# EAGLE design main (EAGLE 5.11)
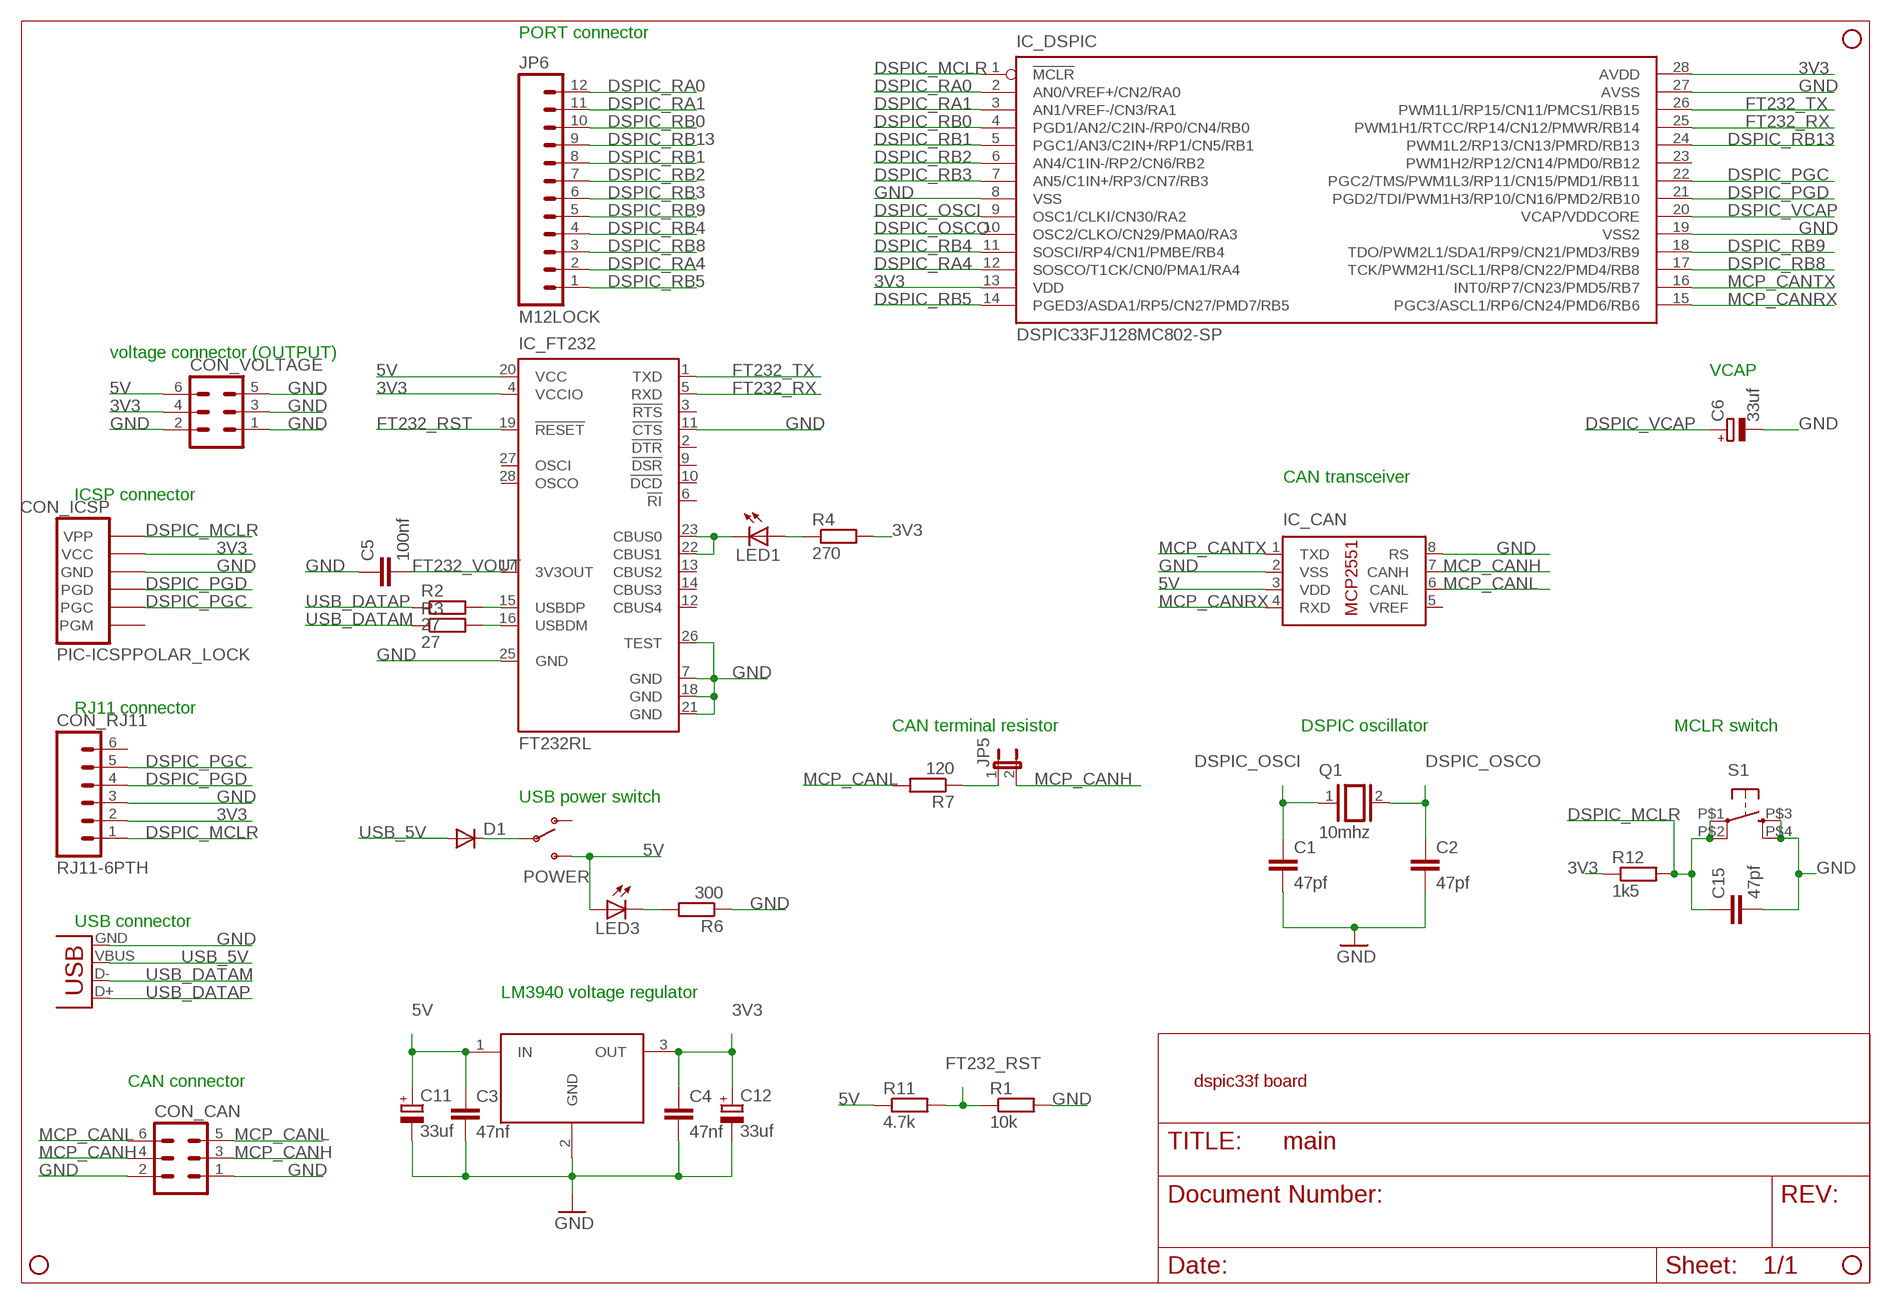
[diagram p0: schematic, sheet 1]

## Parts
C1  47pf  C-EU025-025X050  [C025-025X050]
C2  47pf  C-EU025-025X050  [C025-025X050]
C3  47nf  C-EU025-025X050  [C025-025X050]
C4  47nf  C-EU025-025X050  [C025-025X050]
C5  100nf  C-EU025-025X050  [C025-025X050]
C6  33uf  CPOL-EUE2,5-6E  [E2,5-6E]
C11  33uf  CPOL-EUE2,5-6E  [E2,5-6E]
C12  33uf  CPOL-EUE2,5-6E  [E2,5-6E]
C15  47pf  C-EU025-025X050  [C025-025X050]
CON_CAN  MA03-2  [MA03-2]
CON_ICSP  PIC-ICSPPOLAR_LOCK  [MOLEX-1X6_LOCK]
CON_RJ11  RJ11-6PTH  [RJ11-6]
CON_USB  USBPTH  [USB-B-PTH]
CON_VOLTAGE  MA03-2  [MA03-2]
D1  DIODE1N4148  [DIODE-1N4148]
IC_CAN  MCP2551/P  [DIL08]
IC_DSPIC  DSPIC33FJ128MC802-SP  [DIL28-3]
IC_FT232  FT232RL  [SSOP28]
IT1  LM3940IT-3.3  [TO220V]
JP2  STAND-OFF  [STAND-OFF]
JP3  STAND-OFF  [STAND-OFF]
JP4  STAND-OFF  [STAND-OFF]
JP5  JUMPER-2PTH  [1X02]
JP6  M12LOCK  [1X12_LOCK]
LED1  LED3MM  [LED3MM]
LED3  LED3MM  [LED3MM]
POWER  SWITCH-SPSTKIT  [SWITCH-SPDT_KIT]
Q1  10mhz  XTAL/S  [QS]
R1  10k  R-EU_0207/10  [0207/10]
R2  27  R-EU_0207/10  [0207/10]
R3  27  R-EU_0207/10  [0207/10]
R4  270  R-EU_0207/10  [0207/10]
R6  300  R-EU_0207/10  [0207/10]
R7  120  R-EU_0207/10  [0207/10]
R11  4.7k  R-EU_0207/10  [0207/10]
R12  1k5  R-EU_0207/10  [0207/10]
S1  TAC_SWITCHKSA_SEALED  [KSA_SEALED_TAC_SWITCH]

## Nets
3V3: C4.1 C12.+ CON_ICSP.5(VCC) CON_RJ11.2 CON_VOLTAGE.4 IC_DSPIC.13(VDD) IC_DSPIC.28(AVDD) IC_FT232.4(VCCIO) IT1.3(OUT) R4.2 R12.1
5V: C3.1 C11.+ CON_VOLTAGE.6 IC_CAN.3(VDD) IC_FT232.20(VCC) IT1.1(IN) LED3.A POWER.3(S) R11.1
DSPIC_MCLR: C15.1 CON_ICSP.6(VPP) CON_RJ11.1 IC_DSPIC.1(!MCLR) R12.2 S1.P$1 S1.P$2
DSPIC_OSCI: C1.1 IC_DSPIC.9(OSC1/CLKI/CN30/RA2) Q1.1
DSPIC_OSCO: C2.1 IC_DSPIC.10(OSC2/CLKO/CN29/PMA0/RA3) Q1.2
DSPIC_PGC: CON_ICSP.2(PGC) CON_RJ11.5 IC_DSPIC.22(PGC2/TMS/PWM1L3/RP11/CN15/PMD1/RB11)
DSPIC_PGD: CON_ICSP.3(PGD) CON_RJ11.4 IC_DSPIC.21(PGD2/TDI/PWM1H3/RP10/CN16/PMD2/RB10)
DSPIC_RA0: IC_DSPIC.2(AN0/VREF+/CN2/RA0) JP6.12
DSPIC_RA1: IC_DSPIC.3(AN1/VREF-/CN3/RA1) JP6.11
DSPIC_RA4: IC_DSPIC.12(SOSCO/T1CK/CN0/PMA1/RA4) JP6.2
DSPIC_RB0: IC_DSPIC.4(PGD1/AN2/C2IN-/RP0/CN4/RB0) JP6.10
DSPIC_RB1: IC_DSPIC.5(PGC1/AN3/C2IN+/RP1/CN5/RB1) JP6.8
DSPIC_RB2: IC_DSPIC.6(AN4/C1IN-/RP2/CN6/RB2) JP6.7
DSPIC_RB3: IC_DSPIC.7(AN5/C1IN+/RP3/CN7/RB3) JP6.6
DSPIC_RB4: IC_DSPIC.11(SOSCI/RP4/CN1/PMBE/RB4) JP6.4
DSPIC_RB5: IC_DSPIC.14(PGED3/ASDA1/RP5/CN27/PMD7/RB5) JP6.1
DSPIC_RB8: IC_DSPIC.17(TCK/PWM2H1/SCL1/RP8/CN22/PMD4/RB8) JP6.3
DSPIC_RB9: IC_DSPIC.18(TDO/PWM2L1/SDA1/RP9/CN21/PMD3/RB9) JP6.5
DSPIC_RB13: IC_DSPIC.24(PWM1L2/RP13/CN13/PMRD/RB13) JP6.9
DSPIC_VCAP: C6.+ IC_DSPIC.20(VCAP/VDDCORE)
FT232_RST: IC_FT232.19(!RESET) R1.1 R11.2
FT232_RX: IC_DSPIC.25(PWM1H1/RTCC/RP14/CN12/PMWR/RB14) IC_FT232.5(RXD)
FT232_TX: IC_DSPIC.26(PWM1L1/RP15/CN11/PMCS1/RB15) IC_FT232.1(TXD)
FT232_VOUT: C5.2 IC_FT232.17(3V3OUT)
GND: C1.2 C2.2 C3.2 C4.2 C5.1 C6.- C11.- C12.- C15.2 CON_CAN.1 CON_CAN.2 CON_ICSP.4(GND) CON_RJ11.3 CON_USB.GND CON_VOLTAGE.1 CON_VOLTAGE.2 CON_VOLTAGE.3 CON_VOLTAGE.5 IC_CAN.2(VSS) IC_CAN.8(RS) IC_DSPIC.8(VSS) IC_DSPIC.19(VSS2) IC_DSPIC.27(AVSS) IC_FT232.7(GND) IC_FT232.11(!CTS) IC_FT232.18(GND) IC_FT232.21(GND) IC_FT232.25(GND) IC_FT232.26(TEST) IT1.2(GND) R1.2 R6.1 S1.P$3 S1.P$4
MCP_CANH: CON_CAN.3 CON_CAN.4 IC_CAN.7(CANH) JP5.2
MCP_CANL: CON_CAN.5 CON_CAN.6 IC_CAN.6(CANL) R7.2
MCP_CANRX: IC_CAN.4(RXD) IC_DSPIC.15(PGC3/ASCL1/RP6/CN24/PMD6/RB6)
MCP_CANTX: IC_CAN.1(TXD) IC_DSPIC.16(INT0/RP7/CN23/PMD5/RB7)
N$1: D1.C POWER.2(P)
N$2: LED3.K(C) R6.2
N$4: JP5.1 R7.1
N$13: IC_FT232.15(USBDP) R2.2
N$17: IC_FT232.16(USBDM) R3.2
N$18: IC_FT232.22(CBUS1) IC_FT232.23(CBUS0) LED1.K(C)
N$20: LED1.A R4.1
USB_5V: CON_USB.VBUS D1.A
USB_DATAM: CON_USB.D- R3.1
USB_DATAP: CON_USB.D+ R2.1
Unconnected: CON_ICSP.1(PGM) CON_RJ11.6 IC_CAN.5(VREF) IC_DSPIC.23(PWM1H2/RP12/CN14/PMD0/RB12) IC_FT232.2(!DTR) IC_FT232.3(!RTS) IC_FT232.6(!RI) IC_FT232.9(!DSR) IC_FT232.10(!DCD) IC_FT232.12(CBUS4) IC_FT232.13(CBUS2) IC_FT232.14(CBUS3) IC_FT232.27(OSCI) IC_FT232.28(OSCO) POWER.1(O)

## Notes on the sheet
- PORT connector
- voltage connector (OUTPUT)
- VCAP
- CAN transceiver
- ICSP connector
- RJ11 connector
- CAN terminal resistor | DSPIC oscillator | MCLR switch
- USB power switch
- USB connector
- LM3940 voltage regulator
- CAN connector | dspic33f board

## Library data of the parts
C1-C5 C15 = resistor:C-EU: CAPACITOR, European symbol
C6 C11 C12 = resistor:CPOL-EU: POLARIZED CAPACITOR, European symbol
CON_CAN CON_VOLTAGE = con-lstb:MA03-2: PIN HEADER; OC_FARNELL: unknown; OC_NEWARK: unknown
CON_ICSP = SparkFun:PIC-ICSP: ISCP Programming connector for UAV, UBW Kit, etc.
CON_RJ11 = SparkFun:RJ11-6: RJ11 Jack Simple 6 pin RJ11 jack. Commonly found on CAT3 devices and Microchip programmers. SKU: PRT-00132
CON_USB = SparkFun:USB: USB Connectors USB-B-PTH is fully proven SKU : PRT-00139 USB-miniB is fully proven SKU : PRT-00587 USB-A-PCB is untested. USB-A-H is throughly reviewed, but untested. Spark Fun Electronics SKU : PRT-00437 USB-B-SMT is throughly reviewed, but untested. Needs silkscreen touching up. USB-A-S has not been used/tested USB-MB-H has not been used/tested
D1 = SparkFun:DIODE: Diode These are standard reverse protection diodes and small signal diodes. SMA package can handle up to about 1A. SOD-323 can handle about 200mA. What the SOD-323 package when ordering, there are some mfgs out there that are 5-pin packages.
IC_CAN = microchip-dspic:MCP2551: High-Speed CAN Transceiver
IC_DSPIC = microchip-dspic33fjxxmc:DSPIC33FJ128MC802: High-Performance, 16-bit Digital Signal Controllers - dsPIC33FJ32MC302/304, dsPIC33FJ64MCX02/X04, AND dsPIC33FJ128MCX02/X04 Package: 28-Pin SDIP, SOIC, QFN-S Operating Range: . Up to 40 MIPS operation (at 3.0-3.6V): - Industrial temperature range (-40°C to +85°C) - Extended temperature range (-40°C to +125°C) High-Performance DSC CPU: . Modified Harvard architecture . C compiler optimized instruction set . 16-bit wide data path . 24-bit wide instructions . Linear program memory addressing up to 4M instruction words . Linear data memory addressing up to 64 Kbytes . 83 base instructions: mostly 1 word/1 cycle . Two 40-bit accumulators with rounding and saturation options . Flexible and powerful addressing modes: - Indirect - Modulo - Bit-Reversed . Software stack . 16 x 16 fractional/integer multiply operations . 32/16 and 16/16 divide operations . Single-cycle multiply and accumulate: - Accumulator write back for DSP operations - Dual data fetch . Up to ±16-bit shifts for up to 40-bit data On-Chip Flash and SRAM: . Flash program memory . Data SRAM . Boot, Secure, and General Security for program Flash Direct Memory Access (DMA): . 8-channel hardware DMA . Up to 2 Kbytes dual ported DMA buffer area (DMA RAM) to store data transferred via DMA: - Allows data transfer between RAM and a peripheral while CPU is executing code (no cycle stealing) . Most peripherals support DMA Timers/Capture/Compare/PWM: . Timer/Counters, up to five 16-bit timers: - Can pair up to make two 32-bit timers - One timer runs as a Real-Time Clock with an external 32.768 kHz oscillator - Programmable prescaler . Input Capture (up to four channels): - Capture on up, down or both edges - 16-bit capture input functions - 4-deep FIFO on each capture . Output Compare (up to four channels): - Single or Dual 16-bit Compare mode - 16-bit Glitchless PWM mode . Hardware Real-Time Clock/Calendar (RTCC): - Provides clock, calendar, and alarm functions Interrupt Controller: . 5-cycle latency . 118 interrupt vectors . Up to 49 available interrupt sources . Up to three external interrupts . Seven programmable priority levels . Five processor exceptions Digital I/O: . Peripheral pin Select functionality . Up to 35 programmable digital I/O pins . Wake-up/Interrupt-on-Change for up to 21 pins . Output pins can drive from 3.0V to 3.6V . Up to 5V output with open drain configuration . All digital input pins are 5V tolerant . 4 mA sink on all I/O pins System Management: . Flexible clock options: - External, crystal, resonator, internal RC - Fully integrated Phase-Locked Loop (PLL) - Extremely low jitter PLL . Power-up Timer . Oscillator Start-up Timer/Stabilizer . Watchdog Timer with its own RC oscillator . Fail-Safe Clock Monitor . Reset by multiple sources Power Management: . On-chip 2.5V voltage regulator . Switch between clock sources in real time . Idle, Sleep, and Doze modes with fast wake-up Analog-to-Digital Converters (ADCs): . 10-bit, 1.1 Msps or 12-bit, 500 Ksps conversion: - Two and four simultaneous samples (10-bit ADC) - Up to 13 input channels with auto-scanning - Conversion start can be manual or synchronized with one of four trigger sources - Conversion possible in Sleep mode - ±2 LSb max integral nonlinearity - ±1 LSb max differential nonlinearity Audio Digital-to-Analog Converter (DAC): . 16-bit Dual Channel DAC module . 100 Ksps maximum sampling rate . Second-Order Digital Delta-Sigma Modulator Data Converter Interface (DCI) module: . Codec interface . Supports I2S and AC.97 protocols . Up to 16-bit data words, up to 16 words per frame . 4-word deep TX and RX buffers Comparator Module: . Two analog comparators with programmable input/output configuration CMOS Flash Technology: . Low-power, high-speed Flash technology . Fully static design . 3.3V (±10%) operating voltage . Industrial and Extended temperature . Low power consumption Communication Modules: . 4-wire SPI (up to two modules): - Framing supports I/O interface to simple codecs - Supports 8-bit and 16-bit data - Supports all serial clock formats and sampling modes . I2C?: - Full Multi-Master Slave mode support - 7-bit and 10-bit addressing - Bus collision detection and arbitration - Integrated signal conditioning - Slave address masking . UART (up to two modules): - Interrupt on address bit detect - Interrupt on UART error - Wake-up on Start bit from Sleep mode - 4-character TX and RX FIFO buffers - LIN bus support - IrDA® encoding and decoding in hardware - High-Speed Baud mode - Hardware Flow Control with CTS and RTS . Enhanced CAN (ECAN. module) 2.0B active: - Up to eight transmit and up to 32 receive buffers - 16 receive filters and three masks - Loopback, Listen Only and Listen All - Messages modes for diagnostics and bus monitoring - Wake-up on CAN message - Automatic processing of Remote Transmission Requests - FIFO mode using DMA - DeviceNet. addressing support . Parallel Master Slave Port (PMP/EPSP): - Supports 8-bit or 16-bit data - Supports 16 address lines . Programmable Cyclic Redundancy Check (CRC): - Programmable bit length for the CRC generator polynomial (up to 16-bit length) - 8-deep, 16-bit or 16-deep, 8-bit FIFO for data input
IC_FT232 = ftdichip:FT232R: Source: http://www.ftdichip.com/Documents/DataSheets/DS_FT232R_v104.pdf; MPN: FT232RL; OC_FARNELL: 1146032; OC_NEWARK: 91K9918
IT1 = LM3940:LM3940IT-3.3: 1A Low Dropout Regulator for 5V to 3.3V Conversion
JP2-JP4 = SparkFun:STAND-OFF: Stand Off This is the mechanical footprint for a #4 phillips button head screw. Use the keepout ring to avoid running the screw head into surrounding components. SKU : PRT-00447
JP5 = SparkFun:JUMPER-2: Jumper Basic 0.1" spaced jumper. Use with breakaway headers.
JP6 = SparkFun:M12: Header 12 Standard 12-pin 0.1" header. Use with straight break away headers (SKU : PRT-00116), right angle break away headers (PRT-00553), swiss pins (PRT-00743), machine pins (PRT-00117), and female headers (PRT-00115).
LED1 LED3 = led:LED: LED OSRAM: - CHIPLED LG R971, LG N971, LY N971, LG Q971, LY Q971, LO R971, LY R971 LH N974, LH R974 LS Q976, LO Q976, LY Q976 LO Q996 - Hyper CHIPLED LW Q18S LB Q993, LB Q99A, LB R99A - SideLED LS A670, LO A670, LY A670, LG A670, LP A670 LB A673, LV A673, LT A673, LW A673 LH A674 LY A675 LS A676, LA A676, LO A676, LY A676, LW A676 LS A679, LY A679, LG A679 - Hyper Micro SIDELED® LS Y876, LA Y876, LO Y876, LY Y876 LT Y87S - SmartLED LW L88C, LW L88S LB L89C, LB L89S, LG L890 LS L89K, LO L89K, LY L89K LS L896, LA L896, LO L896, LY L896 - TOPLED LS T670, LO T670, LY T670, LG T670, LP T670 LSG T670, LSP T670, LSY T670, LOP T670, LYG T670 LG T671, LOG T671, LSG T671 LB T673, LV T673, LT T673, LW T673 LH T674 LS T676, LA T676, LO T676, LY T676, LB T676, LH T676, LSB T676, LW T676 LB T67C, LV T67C, LT T67C, LS T67K, LO T67K, LY T67K, LW E67C LS E67B, LA E67B, LO E67B, LY E67B, LB E67C, LV E67C, LT E67C LW T67C LS T679, LY T679, LG T679 LS T770, LO T770, LY T770, LG T770, LP T770 LB T773, LV T773, LT T773, LW T773 LH T774 LS E675, LA E675, LY E675, LS T675 LS T776, LA T776, LO T776, LY T776, LB T776 LHGB T686 LT T68C, LB T68C - Hyper Mini TOPLED® LB M676 - Mini TOPLED Santana® LG M470 LS M47K, LO M47K, LY M47K Source: http://www.osram.convergy.de LUXEON: - LUMILED® LXK2-PW12-R00, LXK2-PW12-S00, LXK2-PW14-U00, LXK2-PW14-V00 LXK2-PM12-R00, LXK2-PM12-S00, LXK2-PM14-U00 LXK2-PE12-Q00, LXK2-PE12-R00, LXK2-PE12-S00, LXK2-PE14-T00, LXK2-PE14-U00 LXK2-PB12-K00, LXK2-PB12-L00, LXK2-PB12-M00, LXK2-PB14-N00, LXK2-PB14-P00, LXK2-PB14-Q00 LXK2-PR12-L00, LXK2-PR12-M00, LXK2-PR14-Q00, LXK2-PR14-R00 LXK2-PD12-Q00, LXK2-PD12-R00, LXK2-PD12-S00 LXK2-PH12-R00, LXK2-PH12-S00 LXK2-PL12-P00, LXK2-PL12-Q00, LXK2-PL12-R00 Source: www.luxeon.com KINGBRIGHT: KA-3528ASYC Source: www.kingbright.com
POWER = SparkFun:SWITCH-SPST: SPST Switch Simple slide switch. Spark Fun Electronics SKU : COM-00102
Q1 = special:XTAL/S: CRYSTAL
R1-R4 R6 R7 R11 R12 = resistor:R-EU_: RESISTOR, European symbol
S1 = SparkFun:TAC_SWITCH: Momentary Switch Button commonly used for reset or general input. Spark Fun Electronics SKU : COM-00097

## Net classes
0 default: width 0.203 mm, drill 0.508 mm, clearance 0.203 mm

## Board
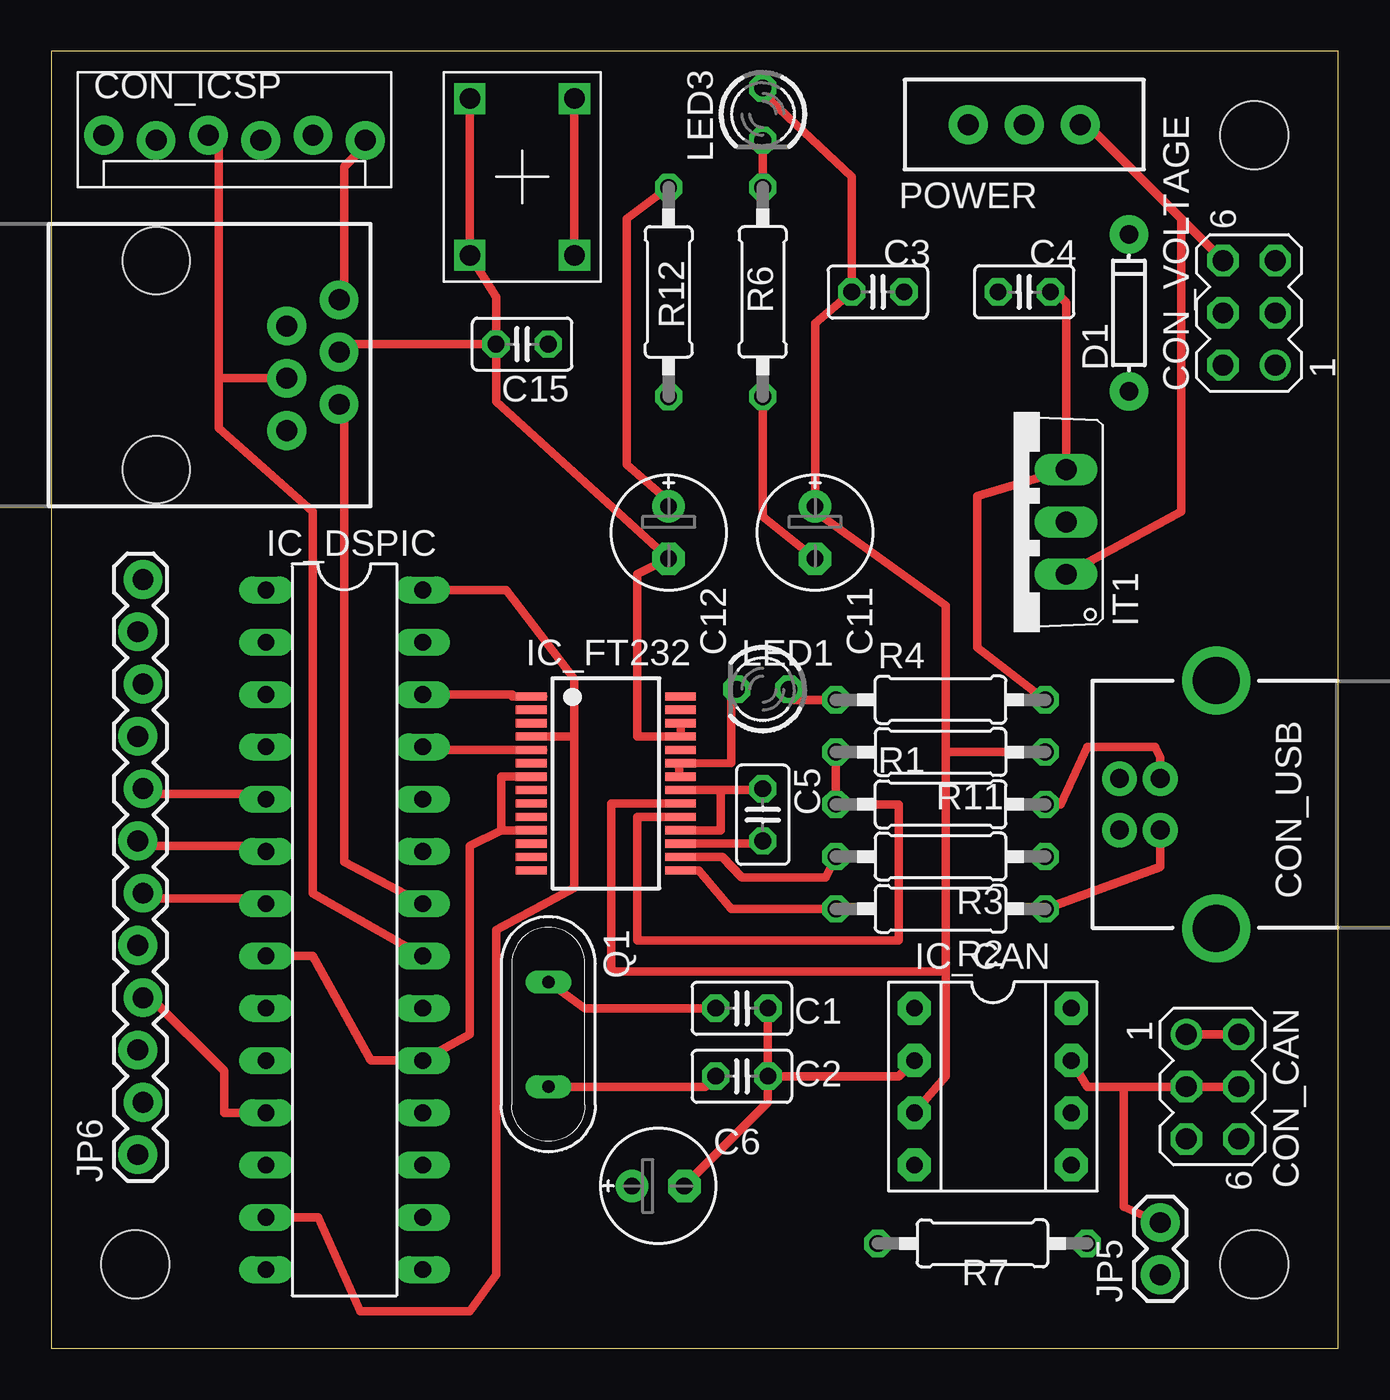
[diagram p1: board, top side]
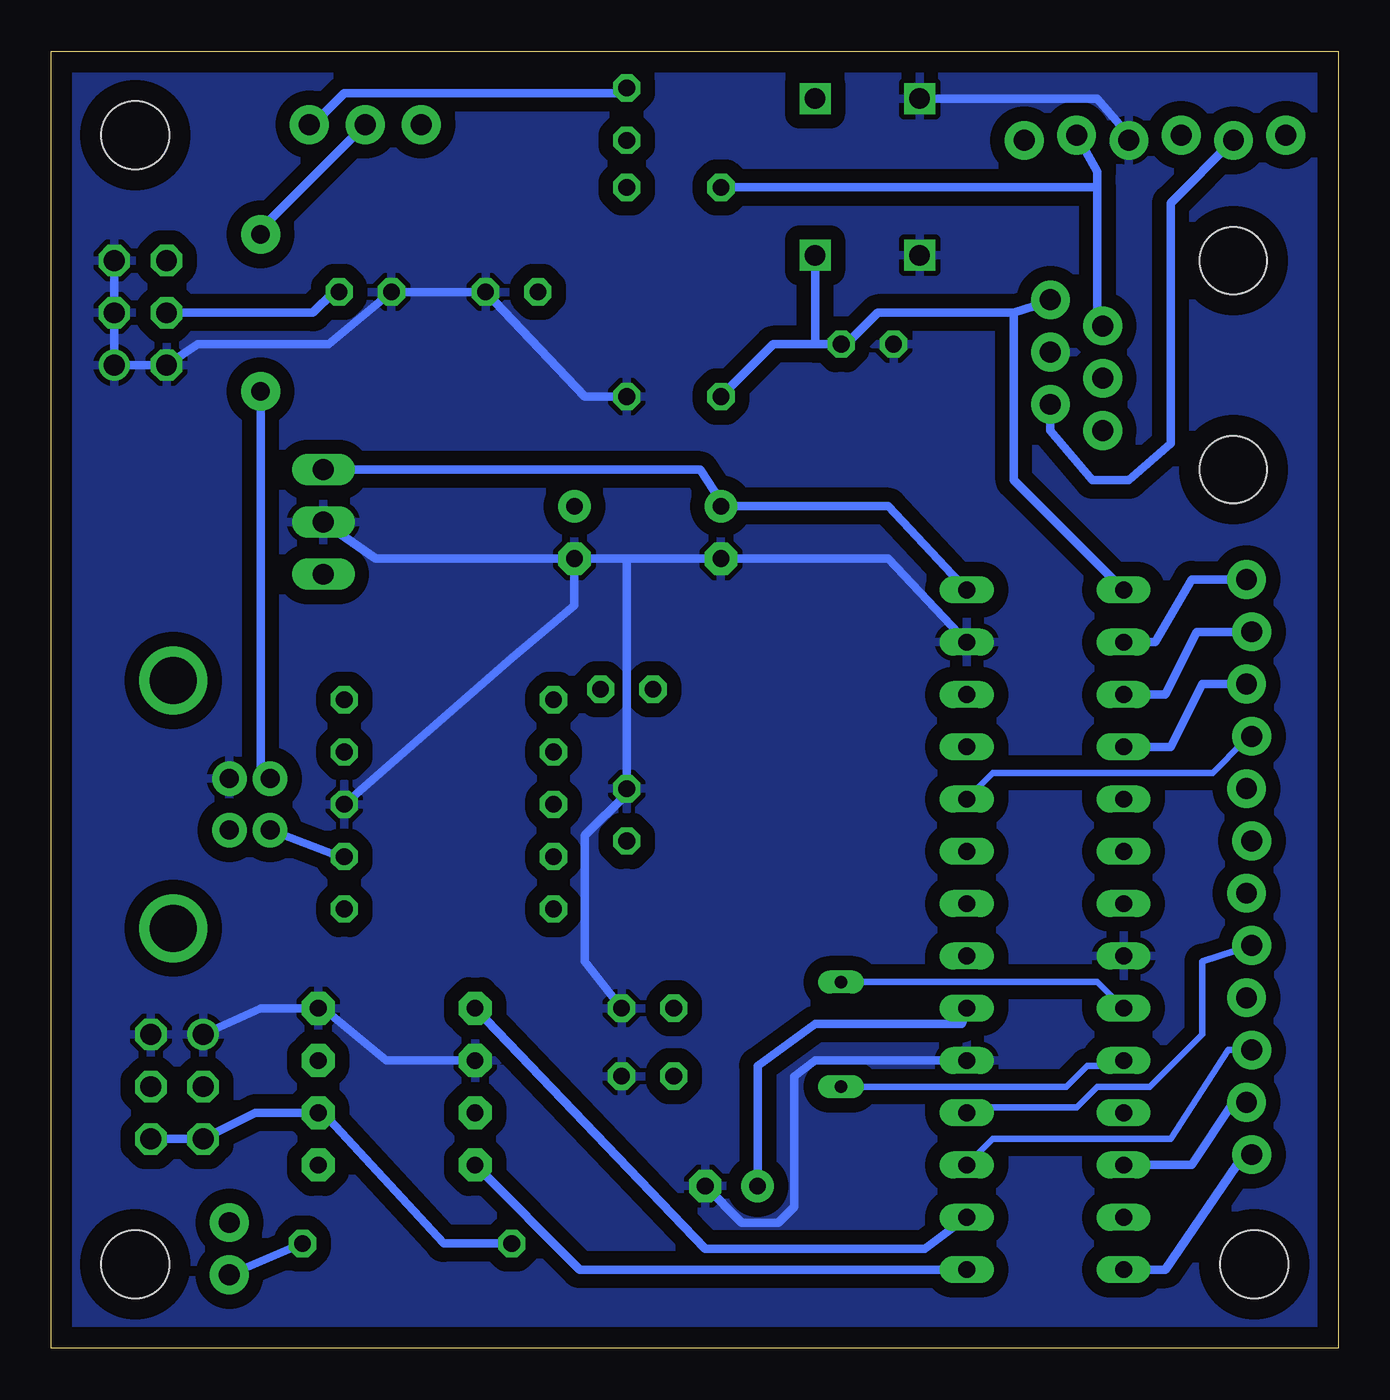
[diagram p2: board, bottom side, seen from below]

Size 62.48 x 62.99 mm. Coordinates in mm from the lower left corner, seen from the top.
Outline: 0,0 62.48,0 62.48,62.99 0,62.99 0,0
Copper layers (1*16): Top 0.035mm / dielectric 1.5mm / Bottom 0.035mm
Design rules "default *": minimum track width 10mil, minimum drill 24mil, track to track 10mil, track to pad 8mil, pad to pad 8mil, via to via 8mil, smd to smd 8mil, copper to edge 40mil, drill to drill 8mil, minimum pad ring 10mil, minimum via ring 8mil, stop-mask expansion 4mil, vias tented up to drill 0mil, thermal gap 10mil

### Footprints (pad centres in the part's own frame; a part is rotated, then mirrored left to right if it is on the bottom)
C025-025X050 = drill 0.813 octagon: 1 -1.27,0; 2 1.27,0
E2,5-6E = drill 0.813 pad 1.575 round: + -1.27,0 | drill 0.813 pad 1.575 octagon: - 1.27,0
MA03-2 = drill 1.016 round: 1 -2.54,-1.27 | drill 1.016 octagon: 2 -2.54,1.27; 3 0,-1.27; 4 0,1.27; 5 2.54,-1.27; 6 2.54,1.27
MOLEX-1X6_LOCK = drill 1.016 pad 1.88 round: 1 0,0; 2 2.54,-0.254; 3 5.08,0; 4 7.62,-0.254; 5 10.16,0; 6 12.7,-0.254
RJ11-6 = drill 1.016 pad 1.88 round: 1 1.905,8.89; 2 3.175,6.35; 3 4.445,8.89; 4 5.715,6.35; 5 6.985,8.89; 6 8.255,6.35 | hole 3.251: 0,0; 10.16,0
USB-B-PTH = drill 0.914 pad 1.676 round: D+ 0,1.25; D- 1.981,1.25; GND 0,-1.25; VBUS 1.981,-1.25 | drill 2.286 round: S1 -2.718,-6.02; S2 -2.718,6.02
DIODE-1N4148 = drill 0.9 pad 1.88 round: A -3.81,0; C 3.81,0
DIL08 = drill 0.813 pad 1.6 octagon: 1 -3.81,-3.81; 2 -1.27,-3.81; 3 1.27,-3.81; 4 3.81,-3.81; 5 3.81,3.81; 6 1.27,3.81; 7 -1.27,3.81; 8 -3.81,3.81
DIL28-3 = drill 0.813 long: 1 -16.51,-3.81; 2 -13.97,-3.81; 3 -11.43,-3.81; 4 -8.89,-3.81; 5 -6.35,-3.81; 6 -3.81,-3.81; 7 -1.27,-3.81; 8 1.27,-3.81; 9 3.81,-3.81; 10 6.35,-3.81; 11 8.89,-3.81; 12 11.43,-3.81; 13 13.97,-3.81; 14 16.51,-3.81; 15 16.51,3.81; 16 13.97,3.81; 17 11.43,3.81; 18 8.89,3.81; 19 6.35,3.81; 20 3.81,3.81; 21 1.27,3.81; 22 -1.27,3.81; 23 -3.81,3.81; 24 -6.35,3.81; 25 -8.89,3.81; 26 -11.43,3.81; 27 -13.97,3.81; 28 -16.51,3.81
SSOP28 = smd 0.4 x 1.5: 1 -4.225,-3.625; 2 -3.575,-3.625; 3 -2.925,-3.625; 4 -2.275,-3.625; 5 -1.625,-3.625; 6 -0.975,-3.625; 7 -0.325,-3.625; 8 0.325,-3.625; 9 0.975,-3.625; 10 1.625,-3.625; 11 2.275,-3.625; 12 2.925,-3.625; 13 3.575,-3.625; 14 4.225,-3.625; 15 4.225,3.625; 16 3.575,3.625; 17 2.925,3.625; 18 2.275,3.625; 19 1.625,3.625; 20 0.975,3.625; 21 0.325,3.625; 22 -0.325,3.625; 23 -0.975,3.625; 24 -1.625,3.625; 25 -2.275,3.625; 26 -2.925,3.625; 27 -3.575,3.625; 28 -4.225,3.625
TO220V = drill 1.016 long: 1 -2.54,-2.54; 2 0,-2.54; 3 2.54,-2.54
STAND-OFF = hole 3.302: 0,0
1X02 = drill 1.016 pad 1.88 round: 1 0,0; 2 2.54,0
1X12_LOCK = drill 1.016 pad 1.88 round: 1 0,0.127; 2 2.54,-0.127; 3 5.08,0.127; 4 7.62,-0.127; 5 10.16,0.127; 6 12.7,-0.127; 7 15.24,0.127; 8 17.78,-0.127; 9 20.32,0.127; 10 22.86,-0.127; 11 25.4,0.127; 12 27.94,-0.127
LED3MM = drill 0.813 octagon: A -1.27,0; K 1.27,0
SWITCH-SPDT_KIT = drill 1.016 pad 1.88 round: 1 0,2.718; 2 0,0; 3 0,-2.718
QS = drill 0.61 long: 1 -2.54,0; 2 2.54,0
0207/10 = drill 0.813 octagon: 1 -5.08,0; 2 5.08,0
KSA_SEALED_TAC_SWITCH = drill 1 square: P$1 -3.81,2.54; P$2 3.81,2.54; P$3 -3.81,-2.54; P$4 3.81,-2.54

### Placement (x,y rotation side)
C1  33.53,16.51 0 top
C2  33.53,13.21 0 top
C3  40.13,51.31 0 top
C4  47.24,51.31 180 top
C5  34.54,25.91 270 top
C6  29.46,7.87 0 top
C11  37.08,39.62 270 top
C12  29.97,39.62 270 top
C15  22.86,48.77 180 top
CON_CAN  56.39,12.7 270 top
CON_ICSP  2.54,58.93 0 top
CON_RJ11  5.08,52.83 270 top
CON_USB  53.85,26.42 180 top
CON_VOLTAGE  58.17,50.29 90 top
D1  52.32,50.29 90 top
IC_CAN  45.72,12.7 270 top
IC_DSPIC  14.22,20.32 270 top
IC_FT232  26.92,27.43 270 top
IT1  46.74,40.13 90 top
JP2  58.42,58.93 0 top
JP3  58.42,4.06 0 top
JP4  4.06,4.06 0 top
JP5  53.85,3.56 90 top
JP6  4.32,9.4 90 top
LED1  34.54,32 180 top
LED3  34.54,59.94 270 top
POWER  47.24,59.44 90 top
Q1  24.13,15.24 270 top
R1  43.18,26.42 0 top
R2  43.18,21.34 180 top
R3  43.18,23.88 180 top
R4  43.18,31.5 0 top
R6  34.54,51.31 90 top
R7  45.21,5.08 180 top
R11  43.18,28.96 180 top
R12  29.97,51.31 270 top
S1  22.86,56.9 270 top

### Tracks (layer width: path | path; a pad name or v marks a point on that pad's centre or on a via)
3V3
  Top 0.406: R4.2 44.96,34.04 44.96,41.4 IT1.3 49.28,50.8 48.77,51.31 C4.1 | R12.1 27.94,54.86 27.94,42.93 29.97,41.15 C12.+ | 25.4,29.71 25.4,32.51 22.1,36.83 IC_DSPIC.28 | 25.4,29.71 IC_FT232.4 | 25.4,29.71 25.4,22.35 21.59,20.32 21.59,3.56 20.32,1.78 14.99,1.78 12.95,6.35 IC_DSPIC.13
  Bottom 0.406: CON_VOLTAGE.4 49.78,50.29 48.77,51.31 C4.1 | 11.68,56.39 11.68,57.15 CON_ICSP.5 | 11.68,56.39 11.68,50.29 CON_RJ11.2 | R12.1 11.68,56.39 | IT1.3 30.99,42.67 29.97,41.15 C12.+ 21.84,40.89 IC_DSPIC.28
5V
  Top 0.406: 54.86,54.86 50.29,59.44 POWER.3 | 54.86,54.86 CON_VOLTAGE.6 | IT1.1 54.86,40.64 54.86,54.86 | LED3.A 34.54,60.96 38.86,56.9 C3.1 37.08,49.78 C11.+ 37.08,40.64 43.43,36.07 43.43,28.96 | IC_CAN.3 43.43,13.21 43.43,18.29 | 43.43,18.29 43.43,28.96 | IC_FT232.20 27.18,26.46 27.18,18.29 43.43,18.29 | 43.43,28.96 R11.1
  Bottom 0.406: POWER.3 49.78,59.44 48.26,60.96 34.54,60.96 LED3.A
DSPIC_MCLR
  Top 0.406: S1.P$2 S1.P$1 | CON_ICSP.6 15.24,58.42 14.22,57.4 14.22,51.31 CON_RJ11.1
  Bottom 0.406: R12.2 27.43,48.77 25.4,48.77 | 25.4,48.77 C15.1 23.88,48.77 22.35,50.29 15.75,50.29 | 25.4,48.77 S1.P$2 | 15.75,50.29 15.75,42.16 IC_DSPIC.1 | 15.75,50.29 14.22,50.8 CON_RJ11.1
DSPIC_OSCI
  Top 0.406: C1.1 25.91,16.51 Q1.1
  Bottom 0.305: Q1.1 11.68,17.78 IC_DSPIC.9
DSPIC_OSCO
  Top 0.406: C2.1 31.75,12.7 Q1.2
  Bottom 0.305: Q1.2 13.21,12.7 12.19,13.72 10.67,13.72 IC_DSPIC.10
DSPIC_PGC
  Top 0.406: CON_RJ11.5 14.22,45.59 14.22,23.62 IC_DSPIC.22
  Bottom 0.406: CON_ICSP.2 8.13,55.63 8.13,43.94 10.16,42.16 11.94,42.16 13.97,44.58 CON_RJ11.5
DSPIC_PGD
  Top 0.406: IC_DSPIC.21 12.7,22.1 12.7,40.64 8.13,44.7 8.13,47.12 | 8.13,47.12 CON_RJ11.4 | 8.13,47.12 8.13,58.67 CON_ICSP.3
DSPIC_RA0
  Bottom 0.406: IC_DSPIC.2 8.89,34.29 7.11,37.34 JP6.12
DSPIC_RA1
  Bottom 0.406: IC_DSPIC.3 8.38,31.75 6.86,34.8 JP6.11
DSPIC_RA4
  Bottom 0.406: IC_DSPIC.12 7.11,8.89 5.08,11.94 JP6.2
DSPIC_RB0
  Bottom 0.406: IC_DSPIC.4 8.13,29.21 6.6,32.26 JP6.10
DSPIC_RB1
  Top 0.406: IC_DSPIC.5 10.16,26.92 4.57,26.92 JP6.8
DSPIC_RB2
  Top 0.406: IC_DSPIC.6 10.16,24.38 4.57,24.38 JP6.7
DSPIC_RB3
  Top 0.406: IC_DSPIC.7 10.16,21.84 4.57,21.84 JP6.6
DSPIC_RB4
  Top 0.406: IC_DSPIC.11 8.38,11.43 8.38,13.46 4.83,17.02 JP6.4
DSPIC_RB5
  Bottom 0.406: IC_DSPIC.14 8.38,3.81 4.57,9.4 JP6.1
DSPIC_RB8
  Bottom 0.305: IC_DSPIC.17 16.76,10.16 8.13,10.16 5.33,14.48 JP6.3
DSPIC_RB9
  Bottom 0.305: IC_DSPIC.18 17.78,11.68 12.7,11.68 11.68,12.7 9.14,12.7 6.6,15.24 6.6,18.8 JP6.5
DSPIC_RB13
  Bottom 0.305: IC_DSPIC.24 16.76,27.94 6.1,27.94 4.57,29.46 JP6.9
DSPIC_VCAP
  Bottom 0.406: IC_DSPIC.20 18.29,15.75 25.4,15.75 28.19,13.72 C6.+
FT232_RST
  Top 0.406: R11.2 R1.1 41.15,26.42 41.15,19.81 28.45,19.81 28.45,25.81 IC_FT232.19
FT232_RX
  Top 0.406: IC_DSPIC.25 18.54,29.21 18.77,29.05 22.51,29.05 | 22.51,29.05 23.88,29.06 | 22.51,29.05 IC_FT232.5
FT232_TX
  Top 0.406: IC_DSPIC.26 22.37,31.75 22.37,31.66 IC_FT232.1 | IC_FT232.1 23.89,31.66 | IC_FT232.1
FT232_VOUT
  Top 0.406: IC_FT232.17 34.54,24.51 C5.2
GND
  Top 0.406: S1.P$3 S1.P$4 21.59,51.05 C15.2 | 32.51,27.11 34.54,27.11 C5.1 | 32.51,27.11 IC_FT232.21 | IC_FT232.18 32.51,25.16 32.51,27.11 | IC_FT232.7 21.84,27.76 21.84,25.16 | 21.84,25.16 IC_FT232.11 | CON_CAN.1 CON_CAN.2 | C15.2 14.48,48.77 CON_RJ11.3 | C15.2 21.59,45.97 C12.- 28.45,37.59 28.45,29.71 IC_FT232.25 IC_FT232.26 | R6.1 34.54,40.39 C11.- | 21.84,25.16 21.84,25.15 20.32,24.38 20.32,15.24 IC_DSPIC.19 15.49,13.97 12.7,19.05 IC_DSPIC.8 | C6.- 34.8,11.94 C2.2 | C2.2 41.15,13.21 IC_CAN.2 | C2.2 C1.2 | CON_USB.GND 53.85,28.7 53.59,29.21 50.29,29.21 49.02,26.42 R1.2
  Bottom 0.406: S1.P$3 11.68,60.71 10.16,58.93 CON_ICSP.4 | IC_DSPIC.27 21.84,38.35 C12.- 34.54,38.35 | 34.54,38.35 C11.- | 34.54,38.35 C5.1 34.54,26.92 36.58,24.89 36.58,18.8 C1.2 | IT1.2 46.74,38.35 C11.- | R1.2 40.13,33.53 37.08,36.07 C11.- | R6.1 36.58,46.23 C3.2 C4.2 49.02,48.77 55.37,48.77 CON_VOLTAGE.2 CON_VOLTAGE.1 CON_VOLTAGE.3 CON_VOLTAGE.5 | IC_CAN.2 46.23,13.97 49.28,16.51 IC_CAN.8 52.32,16.51 CON_CAN.1 | 18.29,13.97 25.4,13.97 26.42,13.21 26.42,6.86 27.18,6.1 28.96,6.1 C6.-
  pour Bottom (isolate 0.7): -0.51,63.5 62.99,63.5 62.99,-0.51 -0.51,-0.51
MCP_CANH
  Top 0.406: CON_CAN.4 CON_CAN.3 52.07,12.7 | 52.07,12.7 50.29,12.7 IC_CAN.7 | JP5.2 52.07,6.86 52.07,12.7
MCP_CANL
  Bottom 0.406: R7.2 43.43,5.08 49.28,11.43 IC_CAN.6 52.58,11.43 CON_CAN.5 CON_CAN.6
MCP_CANRX
  Bottom 0.406: IC_DSPIC.15 36.83,3.81 IC_CAN.4
MCP_CANTX
  Bottom 0.406: IC_DSPIC.16 20.07,4.83 30.73,4.83 IC_CAN.1
N$1
  Bottom 0.406: POWER.2 52.32,54.36 D1.C
N$2
  Top 0.406: R6.2 LED3.K
N$4
  Bottom 0.406: R7.1 JP5.1
N$13
  Top 0.406: IC_FT232.15 31.43,23.21 33.02,21.34 R2.2
N$17
  Top 0.406: R3.2 37.59,22.86 33.53,22.86 32.57,23.86 30.98,23.86 IC_FT232.16
N$18
  Top 0.406: IC_FT232.22 30.48,27.94 30.47,28.41 IC_FT232.23 30.99,28.41 33.01,28.41 33.02,32 LED1.K
N$20
  Top 0.406: R4.1 36.07,31.5 LED1.A
USB_5V
  Bottom 0.406: CON_USB.VBUS 52.32,27.94 D1.A
USB_DATAM
  Bottom 0.406: R3.1 48.51,23.88 CON_USB.D-
USB_DATAP
  Top 0.406: R2.1 53.85,23.37 CON_USB.D+